# Altium schematic sheet TOP.SchDoc
size Legal
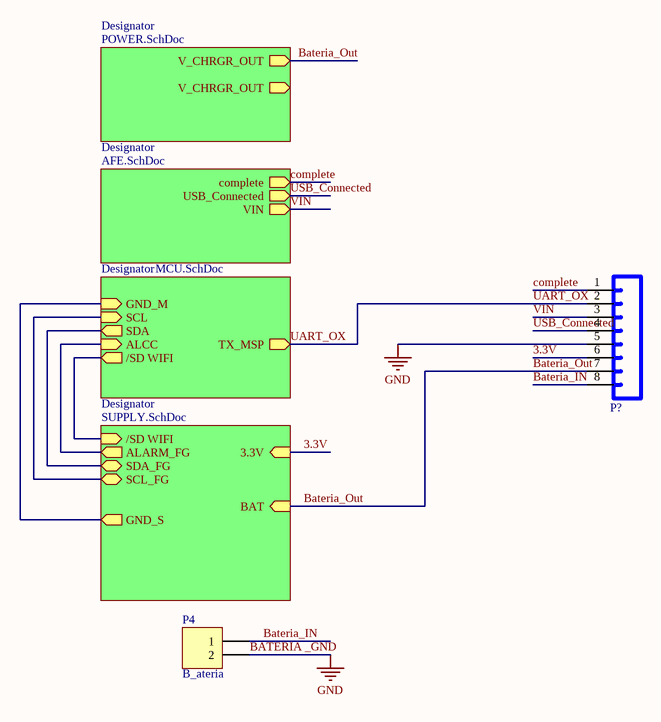
[diagram p0: TOP.SchDoc]

## Parts
P4  B_ateria  [HDR1X2]
P?  68000-236HLF  [HEAD8-NOSS]  (value not drawn)

## Sub-sheets
Designator = SUPPLY.SchDoc: SDA_FG (bidir), SCL_FG (bidir), ALARM_FG (out), /SD WIFI (in), 3.3V (in), BAT (in), GND_S (out)
Designator = MCU.SchDoc: SCL (in), SDA (out), ALCC (in), /SD WIFI (out), TX_MSP (out), GND_M (in)
Designator = AFE.SchDoc: complete (out), USB_Connected (out), VIN (out)
Designator = POWER.SchDoc: V_CHRGR_OUT (out), V_CHRGR_OUT (out)

## Nets
BATERIA _GND: P4.2 P?.5  [also labelled GND]
3.3V: P?.6 ; sheet Designator/3.3V
Bateria_IN: P4.1 P?.8
Bateria_Out: P?.7 ; sheet Designator/BAT, sheet Designator/V_CHRGR_OUT
complete: P?.1 ; sheet Designator/complete
UART_OX: P?.2 ; sheet Designator/TX_MSP
USB_Connected: P?.4 ; sheet Designator/USB_Connected
VIN: P?.3 ; sheet Designator/VIN
(unnamed): sheet Designator/SDA_FG, sheet Designator/SDA
(unnamed): sheet Designator/SCL_FG, sheet Designator/SCL
(unnamed): sheet Designator/ALARM_FG, sheet Designator/ALCC
(unnamed): sheet Designator//SD WIFI, sheet Designator//SD WIFI
(unnamed): sheet Designator/GND_S, sheet Designator/GND_M

## Notes on the sheet
- Proyecto:
- CENTRO DE INGENIERIA Y DESARROLLO INDUSTRIAL
- Titulo:
- Fecha:
- Hoja:
- Elaborado por:
- de
- Hora:
- Revisión:
- Revisado por:
- CIDESI_template_legal

## Library data of the parts
P4 = Header 2: Header, 2-Pin; LatestRevisionDate: 17-Jul-2002; LatestRevisionNote: Re-released for DXP Platform.; Publisher: Altium Limited
P? = HEADER 1X8: Manufacturer: Amphenol FCI; Current Rating: 3 A; Mounting Angle: Straight; Number of Positions: 36 Position; Voltage Rating: 1.5 kV; Pitch: 2.54 mm; Insulation Resistance: 5 GOhms; Mating Post Length: 5.84 mm; Supplier 1: Mouser; Manufacturer Part Number: 68000-236HLF; RoHS: RoHS Compliant; Category: Headers & Wire Housings; Stock 1: 1164; Pricing 1: 1=1.89, 10=1.65, 100=1.47, 200=1.42, 500=1.23, 1000=1.00 (MXN); Contact Plating: Gold; Housing Material: Thermoplastic (TP); Number of Rows: 1 Row; Packaging: Bulk; Product: Headers; Termination Style: Solder Pin; Type: Pin Strip; Brand: Amphenol FCI; Contact Material: Phosphor Bronze; Flammability Rating: UL 94 V-0; Mounting Style: -; Contact Gender: Pin (Male); Housing Color: Black; Housing Gender: -; Maximum Operating Temperature: + 125 C; Minimum Operating Temperature: - 65 C; Product Type: Headers & Wire Housings; Standard Pack Qty: 100; Subcategory: Headers & Wire Housings; Termination Post Length: 2.41 mm; Tradename: BergStik; RoHS - Mouser: Y; Minimum Order Quantity: 1; Reeling: False; ComponentLink1URL: https://www.mouser.com/datasheet/2/18/68000-1266375.pdf; ComponentLink1Description: https://www.mouser.com/datasheet/2/18/68000-1266375.pdf; Supplier Part Number 1: 649-68000-236HLF